# EAGLE design GunDelSol_3 (EAGLE 9.6.2)
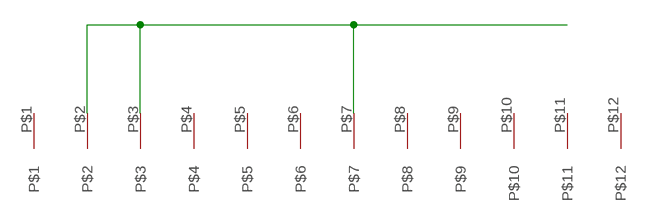
[diagram p0: schematic, sheet 1]

## Parts
U$1  BEAST  [BEAST]

## Nets
N$1: U$1.P$2 U$1.P$3 U$1.P$7
Unconnected: U$1.P$1 U$1.P$4 U$1.P$5 U$1.P$6 U$1.P$8 U$1.P$9 U$1.P$10 U$1.P$11 U$1.P$12

## Library data of the parts
U$1 = beastpins:BEAST

## Board
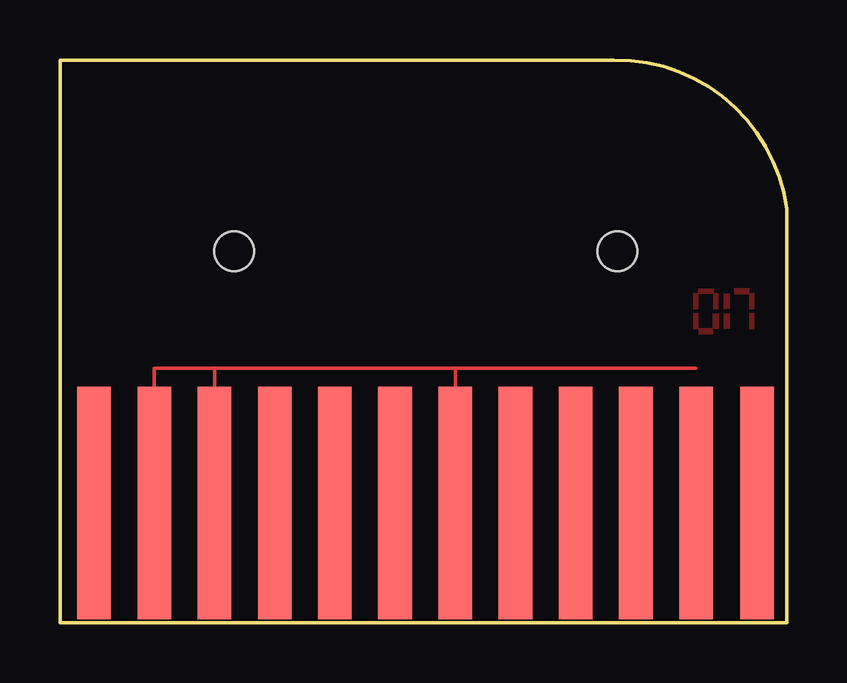
[diagram p1: board, top side]

Size 30.3 x 23.45 mm. Coordinates in mm from the lower left corner, seen from the top.
Outline: 0,0 30.3,0 30.3,17.25 arc83 23.1,23.45 0,23.45 0,0
Copper layers (1*16): Top 0.035mm / dielectric 1.5mm / Bottom 0.035mm
Design rules "default *": minimum track width 6mil, minimum drill 0.35mm, track to track 1mil, track to pad 6mil, pad to pad 6mil, via to via 6mil, smd to smd 6mil, copper to edge 0.002540625mm, drill to drill 1mil, minimum pad ring 10mil, minimum via ring 8mil, stop-mask expansion 4mil, vias tented up to drill 0mil, thermal gap 10mil
Holes 1.65 mm at 7.27,15.49 23.23,15.49

### Footprints (pad centres in the part's own frame; a part is rotated, then mirrored left to right if it is on the bottom)
BEAST = smd 1.4 x 9.7: P$1 -27.61,5.02; P$2 -25.1,5.02; P$3 -22.59,5.02; P$4 -20.08,5.02; P$5 -17.57,5.02; P$6 -15.06,5.02; P$7 -12.55,5.02; P$8 -10.04,5.02; P$9 -7.53,5.02; P$10 -5.02,5.02; P$11 -2.51,5.02; P$12 0.03,5.02

### Placement (x,y rotation side)
U$1  29.03,-0.03 0 top

### Tracks (layer width: path | path; a pad name or v marks a point on that pad's centre or on a via)
N$1
  Top 0.152: 3.93,10.6 4.02,10.6 | 4.02,10.6 6.51,10.6 | 6.51,10.6 16.5,10.6 | 16.5,10.6 26.52,10.6 | U$1.P$2 3.93,10.51 4.02,10.6 | U$1.P$3 6.44,10.53 6.51,10.6 | U$1.P$7 16.48,10.58 16.5,10.6
N$2
  pour Top: 26.63,12.25 26.63,12.04 27.23,12.04 27.23,12.25
N$3
  pour Top: 26.41,12.88 26.41,12.25 26.62,12.25 26.62,12.88
N$4
  pour Top: 27.25,13.72 27.25,13.09 27.46,13.09 27.46,13.72
N$5
  pour Top: 27.23,13.72 26.63,13.72 26.63,13.93 27.23,13.93
N$6
  pour Top: 28.11,13.93 28.11,13.72 28.73,13.72 28.73,13.93
N$8
  pour Top: 27.91,12.25 27.7,12.25 27.7,12.88 27.91,12.88
N$11
  pour Top: 27.91,13.09 27.7,13.09 27.7,13.72 27.91,13.72
N$18
  pour Top: 27.46,12.25 27.25,12.25 27.25,12.88 27.46,12.88
N$25
  pour Top: 26.41,13.72 26.41,13.09 26.62,13.09 26.62,13.72
N$28
  pour Top: 28.75,12.88 28.75,12.25 28.96,12.25 28.96,12.88
N$32
  pour Top: 28.75,13.72 28.75,13.09 28.96,13.09 28.96,13.72